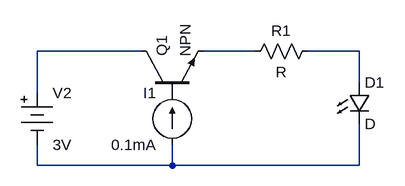
[diagram p0: schematic Necklace.asc]
Necklace.asc, the LTspice schematic file:
Version 4
SHEET 1 880 680
WIRE -160 32 -320 32
WIRE 16 32 -64 32
WIRE 176 32 96 32
WIRE 176 80 176 32
WIRE -320 96 -320 32
WIRE -320 208 -320 176
WIRE -112 208 -112 176
WIRE -112 208 -320 208
WIRE 176 208 176 144
WIRE 176 208 -112 208
SYMBOL res 112 16 R90
WINDOW 0 0 56 VBottom 2
WINDOW 3 32 56 VTop 2
SYMATTR InstName R1
SYMBOL npn -160 96 R270
SYMATTR InstName Q1
SYMBOL current -112 176 R180
WINDOW 0 24 80 Left 2
WINDOW 3 24 0 Left 2
WINDOW 123 0 0 Left 0
WINDOW 39 0 0 Left 0
SYMATTR InstName I1
SYMATTR Value 0.1mA
SYMBOL Misc\\battery -320 80 R0
WINDOW 123 0 0 Left 0
WINDOW 39 0 0 Left 0
SYMATTR InstName V2
SYMATTR Value 3V
SYMBOL LED 160 80 R0
SYMATTR InstName D1

The netlist it stands for:
* Necklace.asc
R1 N003 N002 R
Q1 N001 P001 N002 0 NPN
I1 N004 P001 0.1mA
V2 N001 N004 3V
D1 N003 N004 D
.model D D
.lib standard.dio
.model NPN NPN
.model PNP PNP
.lib standard.bjt
.backanno
.end